# Altium schematic sheet LR2021.SchDoc
size A3; SheetNumber: 9; SheetTotal: 10
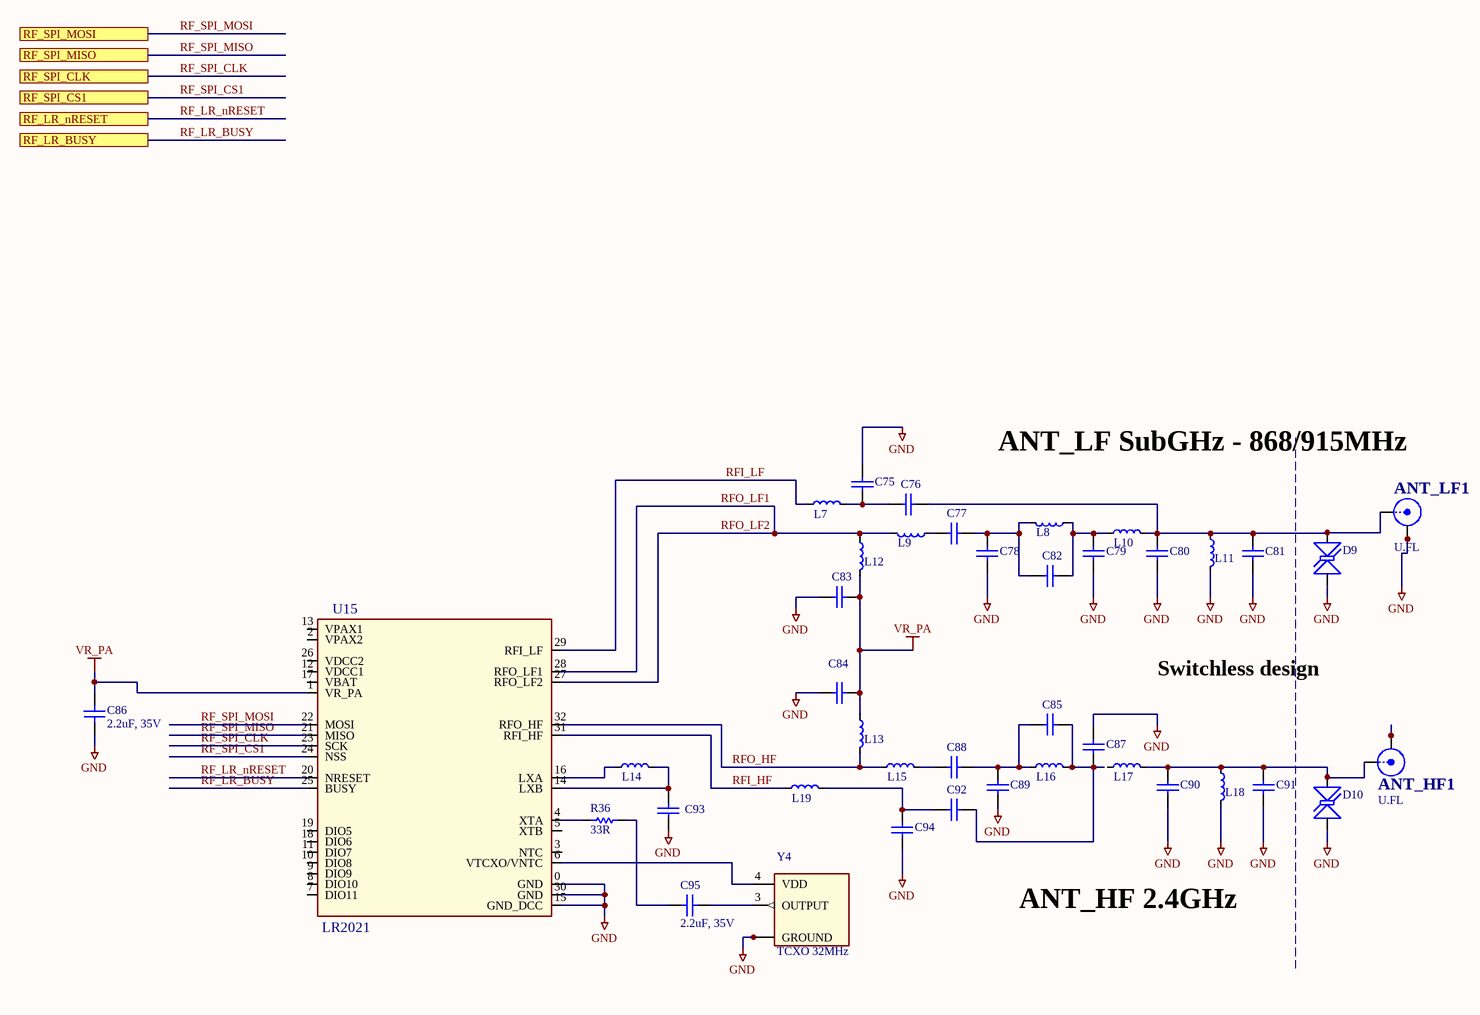
[diagram p0: LR2021.SchDoc]

## Parts
ANT_HF1  U.FL  [U.FL-R-SMT Hirose_2337019-1]
ANT_LF1  U.FL  [U.FL-R-SMT Hirose_2337019-1]
C75  Cap  [c_201_smd]  (value not drawn)
C76  Cap  [c_201_smd]  (value not drawn)
C77  Cap  [c_201_smd]  (value not drawn)
C78  Cap  [c_201_smd]  (value not drawn)
C79  Cap  [c_201_smd]  (value not drawn)
C80  Cap  [c_201_smd]  (value not drawn)
C81  Cap  [c_201_smd]  (value not drawn)
C82  Cap  [c_201_smd]  (value not drawn)
C83  Cap  [c_201_smd]  (value not drawn)
C84  Cap  [c_201_smd]  (value not drawn)
C85  Cap  [c_201_smd]  (value not drawn)
C86  2.2uF, 35V  [0402 resistor]
C87  Cap  [c_201_smd]  (value not drawn)
C88  Cap  [c_201_smd]  (value not drawn)
C89  Cap  [c_201_smd]  (value not drawn)
C90  Cap  [c_201_smd]  (value not drawn)
C91  Cap  [c_201_smd]  (value not drawn)
C92  Cap  [c_201_smd]  (value not drawn)
C93  Cap  [c_201_smd]  (value not drawn)
C94  Cap  [c_201_smd]  (value not drawn)
C95  2.2uF, 35V  [0402 resistor]
D9  TVS Diode  [SLP0603P2X3F]  (value not drawn)
D10  TVS Diode  [SLP0603P2X3F]  (value not drawn)
L7  Inductor symbol  [LQW_201_smd]  (value not drawn)
L8  Inductor symbol  [LQW_201_smd]  (value not drawn)
L9  Inductor symbol  [LQW_201_smd]  (value not drawn)
L10  Inductor symbol  [LQW_201_smd]  (value not drawn)
L11  Inductor symbol  [LQW_201_smd]  (value not drawn)
L12  Inductor symbol  [lqw_402_smd]  (value not drawn)
L13  Inductor symbol  [LQW_201_smd]  (value not drawn)
L14  Inductor symbol  [LQM18P_603_INDUCTOR_SMD]  (value not drawn)
L15  Inductor symbol  [LQW_201_smd]  (value not drawn)
L16  Inductor symbol  [LQW_201_smd]  (value not drawn)
L17  Inductor symbol  [LQW_201_smd]  (value not drawn)
L18  Inductor symbol  [LQW_201_smd]  (value not drawn)
L19  Inductor symbol  [LQW_201_smd]  (value not drawn)
R36  33R  [0603 Resistor]
U15  LR2021  [qfn32l_5x5mm]
Y4  TCXO 32MHz  [XTAL_ECS-400-10-37B2-CKM-TR]

## Ports
RF_LR_BUSY, RF_LR_nRESET, RF_SPI_CLK, RF_SPI_CS1, RF_SPI_MISO, RF_SPI_MOSI

## Nets
GND: ANT_LF1.2(GND) ANT_LF1.3(GND) C75.1 C78.1 C79.1 C80.1 C81.2 C83.1 C84.1 C86.2 C87.1 C89.1 C90.1 C91.1 C93.1 C94.1 D9.1(A) D10.1(A) L11.2 L18.2 U15.0(GND) U15.15(GND_DCC) U15.30(GND) Y4.1(GROUND) Y4.2(GROUND)
VR_PA: C83.2 C84.2 C86.1 L12.1 L13.1 U15.1(VR_PA)
RF_LR_BUSY: U15.25(BUSY) ; port RF_LR_BUSY
RF_LR_nRESET: U15.20(NRESET) ; port RF_LR_nRESET
RF_SPI_CLK: U15.23(SCK) ; port RF_SPI_CLK
RF_SPI_CS1: U15.24(NSS) ; port RF_SPI_CS1
RF_SPI_MISO: U15.21(MISO) ; port RF_SPI_MISO
RF_SPI_MOSI: U15.22(MOSI) ; port RF_SPI_MOSI
RFI_HF: L19.2 U15.31(RFI_HF)
RFI_LF: L7.1 U15.29(RFI_LF)
RFO_HF: L13.2 L15.1 U15.32(RFO_HF)
RFO_LF1: L9.1 L12.2 U15.27(RFO_LF2) U15.28(RFO_LF1)  [also labelled RFO_LF2]
NetANT_HF1_1: ANT_HF1.1(Signal) C90.2 C91.2 D10.2(K) L17.2 L18.1
NetANT_HF1_2: ANT_HF1.2(GND) ANT_HF1.3(GND)
NetANT_LF1_1: ANT_LF1.1(Signal) C76.2 C80.2 C81.1 D9.2(K) L10.2 L11.1
NetC75_2: C75.2 C76.1 L7.2
NetC77_1: C77.1 L9.2
NetC77_2: C77.2 C78.2 C82.1 L8.1
NetC79_2: C79.2 C82.2 L8.2 L10.1
NetC85_1: C85.1 C88.2 C89.2 L16.1
NetC85_2: C85.2 C87.2 C92.2 L16.2
NetC88_1: C88.1 L15.2
NetC92_1: C92.1 C94.2 L19.1
NetC93_2: C93.2 L14.2 U15.14(LXB)
NetC95_1: C95.1 Y4.3(OUTPUT)
NetC95_2: C95.2 R36.2
NetL14_1: L14.1 U15.16(LXA)
NetR36_1: R36.1 U15.4(XTA)
NetU15_6: U15.6(VTCXO/VNTC) Y4.4(VDD)

Not connected (* = marked no-connect by the designer): L17 1; U15 2(VPAX2) 3(NTC) 5(XTB) 7(DIO11) 8(DIO10) 9(DIO9) 10(DIO8) 11(DIO7) 12(VDCC1) 13(VPAX1) 17(VBAT) 18(DIO6) 19(DIO5) 26(VDCC2)

## Notes on the sheet
- ANT_LF SubGHz - 868/915MHz
- Switchless design
- ANT_HF 2.4GHz
- Project:
- Title:
- Sheet number:
- Revision:
- Designer:
- out of
- Date:

## Library data of the parts
ANT_HF1 ANT_LF1 = U.FL: U.FL Hirose RF Connector; LatestRevisionDate: 21-Feb-2012  -  Semtech
C75-C85 C87-C92 C94 = Cap: Capacitor SMD; Value: VAL?; Published: 8-Jun-2000; LatestRevisionDate: 05-oct-2007  -  Semtech; LatestRevisionNote: Re-released for DXP Platform.; Publisher: Altium Limited
C86 C95 = CMP-001-P41-1: 2.2uF, 35V, 10%, 0402
C93 = Cap: Capacitor SMD; Published: 8-Jun-2000; LatestRevisionDate: 05-oct-2007  -  Semtech; LatestRevisionNote: Re-released for DXP Platform.; Publisher: Altium Limited; Value: ?
D9 D10 = TVS Diode: Ultra Low Capacitance 1-line ESD Protection; LatestRevisionDate: 23-Aug-2016; Type: TVS Diode
L7-L13 L15-L19 = Inductor: Code_IEC: 1005; Value: VAL?; Published: 15-Jun-2021; LatestRevisionDate: 15-Jun-2021 -  Semtech; LatestRevisionNote: Re-released for DXP Platform.; Publisher: Altium Limited; Code_JEITA: 0402
L14 = Inductor_DC-DC: Inductor for DC-DC; Code_IEC: 1005; Published: 15-Jun-2021; LatestRevisionDate: 15-Jun-2021 -  Semtech; LatestRevisionNote: Re-released for DXP Platform.; Publisher: Altium Limited; Code_JEITA: 0402; Value: ?
R36 = CMP-001-C30-7: 33R, 1%, 1/10W, 0603; Manufacturer: Panasonic; Manufacturer Part Number: ERJ-3EKF33R0V; Temperature Coefficient: 100ppm/°C; Max Power Dissipation: 100mW; Voltage Rating: 75V; REACH SVHC: No SVHC; Resistance: 33R; Composition: Thick Film; Tolerance: 1%; Lead Free: Lead Free; Contact Plating: Tin; Package Quantity: 1; Number of Terminations: 2; Number of Pins: 2; Case Code (Metric): 1608; Width: 0.031inch; Min Operating Temperature: -55°C; Military Standard: Not; Termination: SMD/SMT; Radiation Hardening: No; Case Code (Imperial): 0603; Mount: Surface Mount; Depth: 0.8mm; Max Operating Temperature: 155°C; Voltage Rating (DC): 75V; Features: Automotive AEC-Q200; Power Rating: 100mW; Packaging: Tape and Reel; Supplier Part Number: P33.0HCT-ND; Length: 1.6mm; Supplier: Digi-Key; Height: 0.022inch; Case/Package: 0603
U15 = LR2021: LR2021 - Low Power Integrated Low Power Multi protocol Transceiver; LatestRevisionDate: 27-Jul-2009 -  Semtech
Y4 = ECSTXO20CSMV320EYTR: 32 MHz TCXO Clipped Sine Wave Oscillator 1.7V ~ 3.465V - 4-SMD, No Lead; MF: ECS Inc.; MP: ECS-TXO-20CSMV-320-EY-TR; SnapEDA_Link: https://www.snapeda.com/parts/ECS-TXO-20CSMV-320-EY-TR/ECS/view-part/?ref=snap; Package: ECS-TXO-20CSMV-0-4 ECS; Value: *; Check_prices: https://www.snapeda.com/parts/ECS-TXO-20CSMV-320-EY-TR/ECS/view-part/?ref=eda; Supplier 1: DigiKey; Supplier Part Number 1: 50-ECS-TXO-20CSMV-320-EY-CT-ND